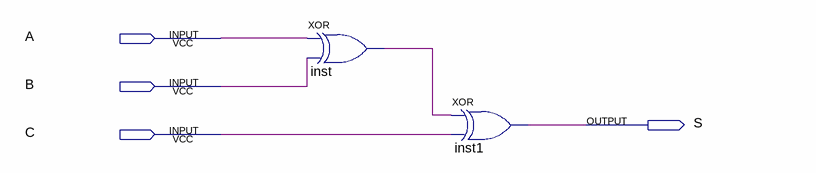
[diagram p0: schematic sheet]
// Quartus schematic xor3.bdf as structural Verilog: 2 symbols, 4 pins
module xor3 (
  input  A,
  input  B,
  input  C,
  output S
);

  wire inst_out;

  xor inst (inst_out, A, B);
  xor inst1 (S, inst_out, C);
endmodule
